# Altium schematic sheet Sheet1.SchDoc
size A4
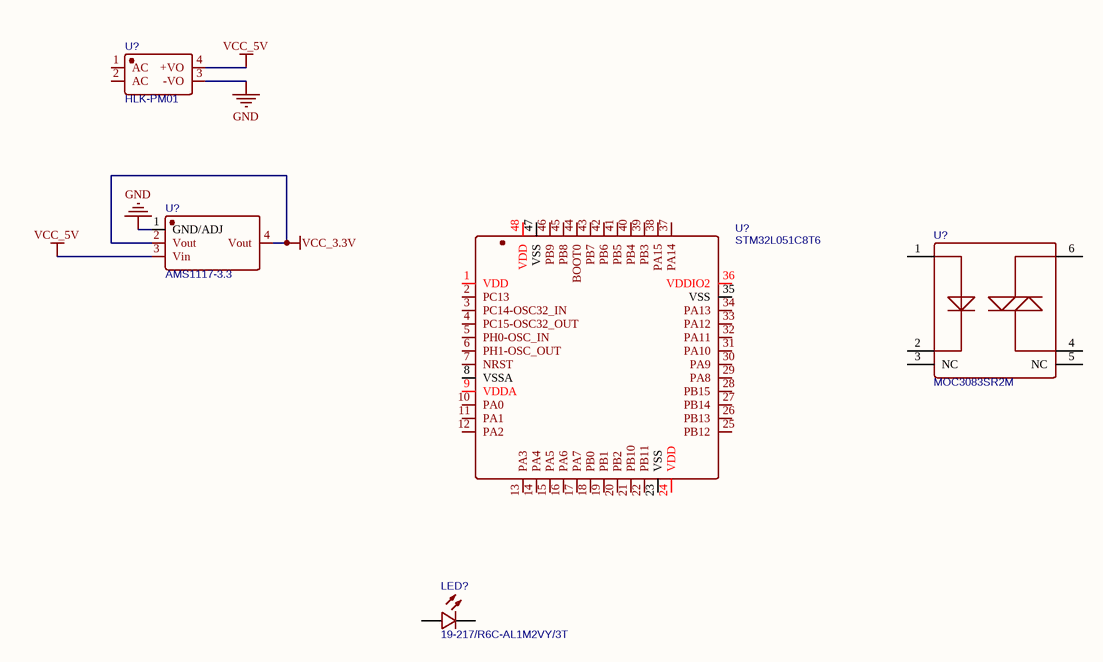
[diagram p0: Sheet1.SchDoc]

## Parts
(Parts that share a designator on the sheet are numbered #1, #2 ... from top to bottom, then left to right.)
LED?  19-217/R6C-AL1M2VY/3T  [LED0603-R-RD]
U?#1  HLK-PM01  [PWRM-TH_HLK-PM01]
U?#2  AMS1117-3.3  [SOT-223-3_L6.5-W3.4-P2.30-LS7.0-BR]
U?#3  MOC3083SR2M  [SMD-6_L8.7-W6.5-P2.54-LS10.6-BL]
U?#4  STM32L051C8T6  [LQFP-48_L7.0-W7.0-P0.50-LS9.0-BL]

## Nets
GND: U?#1.3(-VO) U?#2.1(GND/ADJ)
VCC_3.3V: U?#2.2(Vout) U?#2.4(Vout)
VCC_5V: U?#1.4(+VO) U?#2.3(Vin)

Not connected (* = marked no-connect by the designer): LED? 1(A) 2(C); U?#1 1(AC) 2(AC); U?#3 1 2 3(NC) 4 5(NC) 6; U?#4 1(VDD) 2(PC13) 3(PC14-OSC32_IN) 4(PC15-OSC32_OUT) 5(PH0-OSC_IN) 6(PH1-OSC_OUT) 7(NRST) 8(VSSA) 9(VDDA) 10(PA0) 11(PA1) 12(PA2) 13(PA3) 14(PA4) 15(PA5) 16(PA6) 17(PA7) 18(PB0) 19(PB1) 20(PB2) 21(PB10) 22(PB11) 23(VSS) 24(VDD) 25(PB12) 26(PB13) 27(PB14) 28(PB15) 29(PA8) 30(PA9) 31(PA10) 32(PA11) 33(PA12) 34(PA13) 35(VSS) 36(VDDIO2) 37(PA14) 38(PA15) 39(PB3) 40(PB4) 41(PB5) 42(PB6) 43(PB7) 44(BOOT0) 45(PB8) 46(PB9) 47(VSS) 48(VDD)

## Library data of the parts
LED? = 19-217/R6C-AL1M2VY/3T: BOM_Manufacturer: EVERLIGHT; SMT Type: Extend; BOM_Supplier: LCSC; BOM_Manufacturer Part: 19-217/R6C-AL1M2VY/3T; image: //image.lceda.cn/szlcsc/C72044.jpg; BOM_Supplier Part: C72044; BOM_LCSC Assembly: Yes; spicePre: L; spiceSymbolName: 19-217/R6C-AL1M2VY/3T
U?#1 = HLK-PM01: BOM_Manufacturer: HI-LINK; Contributor: LCSC; BOM_Supplier: LCSC; BOM_Supplier Part: C209903; BOM_Manufacturer Part: HLK-PM01; spicePre: U; spiceSymbolName: HLK-PM01
U?#2 = AMS1117-3.3: BOM_Manufacturer: AMS; sourceId: dwIGgezVh; SMT Type: Basic; timeStamp: 1476261164; BOM_Supplier: LCSC; BOM_Manufacturer Part: AMS1117-3.3; BOM_LCSC Assembly: Yes; image: //image.lceda.cn/szlcsc/C6186.jpg; BOM_Supplier Part: C6186; spicePre: U; spiceSymbolName: AMS1117-3.3
U?#3 = MOC3083SR2M: BOM_Manufacturer: FAIRCHILD; SMT Type: Extend; BOM_Supplier: LCSC; BOM_Manufacturer Part: MOC3083SR2M; BOM_Supplier Part: C111561; BOM_LCSC Assembly: Yes; spicePre: U; spiceSymbolName: MOC3083SR2M
U?#4 = STM32L051C8T6: BOM_Manufacturer: STMicroelectronics; SMT Type: Extend; BOM_Supplier: LCSC; BOM_Manufacturer Part: STM32L051C8T6; BOM_Supplier Part: C110878; BOM_LCSC Assembly: Yes; spicePre: U; spiceSymbolName: STM32L051C8T6